# EAGLE schematic Wheatstone Bridge (EAGLE 7.5.0)
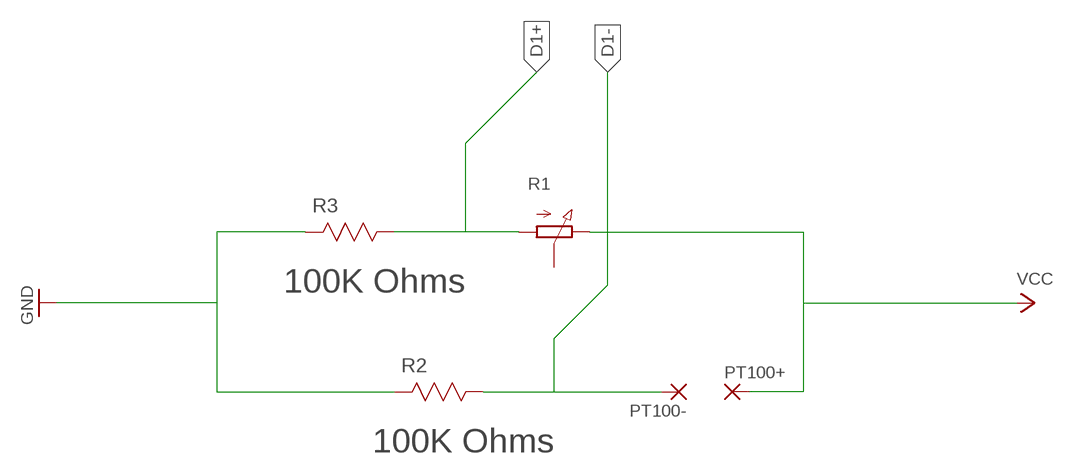
[diagram p0: schematic, sheet 1]

## Parts
PT100+  3,17/1,3  [3,17/1,3]
PT100-  3,17/1,3  [3,17/1,3]
R1  PC25  [PC25]
R2  100K Ohms  PNM0805E1003BST5  [RESC2013X65N]
R3  100K Ohms  PNM0805E1003BST5  [RESC2013X65N]

## Nets
D1+: R1.A R3.1
D1-: PT100-.1(P) R2.1
GND: R2.2 R3.2
VCC: PT100+.1(P) R1.E
Unconnected: R1.S

## Library data of the parts
PT100+ PT100- = wirepad:3,17/1,3: THROUGH-HOLE PAD
R1 = pot-vitrohm:PC25: VITROHM POTENTIOMETER; MF: CLAROSTAT; MPN: 308NPC25KS; OC_FARNELL: 1440998; OC_NEWARK: 03F7518
R2 R3 = Vishay_By_element14_Batch_1:PNM0805E1003BST5: RESISTOR, 0805; MPN: PNM0805E1003BST5; OC_FARNELL: 1857227; OC_NEWARK: 27T2939; SUPPLIER: Vishay; TOLERANCE: ± 0.1 %; WATTAGE: 200mW